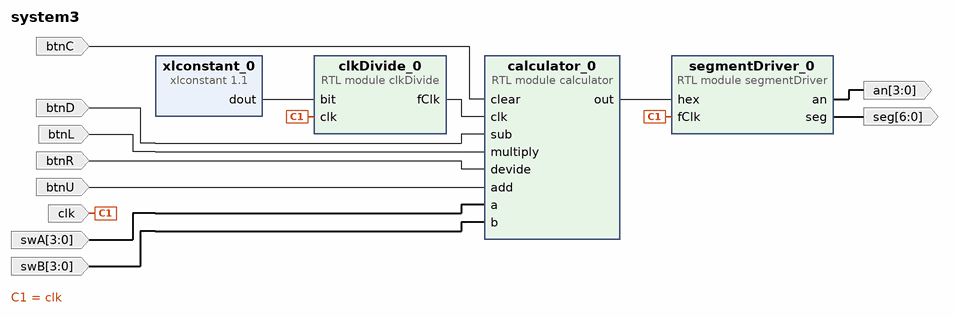
[diagram p0: block diagram of the top level]
# Vivado block design system3, xc7a35tcpg236-1, Vivado 2024.1
create_bd_design system3

create_bd_port -dir I -from 3 -to 0 swA
create_bd_port -dir I -from 3 -to 0 swB
create_bd_port -dir I btnU
create_bd_port -dir I btnD
create_bd_port -dir I btnL
create_bd_port -dir I btnR
create_bd_port -dir I btnC
create_bd_port -dir I clk
create_bd_port -dir O -from 6 -to 0 seg
create_bd_port -dir O -from 3 -to 0 an

create_bd_cell -type module -reference clkDivide clkDivide_0
create_bd_cell -type module -reference segmentDriver segmentDriver_0
create_bd_cell -type module -reference calculator calculator_0
create_bd_cell -type ip -vlnv xilinx.com:ip:xlconstant:1.1 xlconstant_0
set_property -dict {CONFIG.CONST_VAL 10 CONFIG.CONST_WIDTH 5} [get_bd_cells xlconstant_0]

# ---- connections ----

connect_bd_net [get_bd_ports btnC] [get_bd_pins calculator_0/clear]
connect_bd_net [get_bd_ports btnD] [get_bd_pins calculator_0/sub]
connect_bd_net [get_bd_ports btnL] [get_bd_pins calculator_0/multiply]
connect_bd_net [get_bd_ports btnR] [get_bd_pins calculator_0/devide]
connect_bd_net [get_bd_ports btnU] [get_bd_pins calculator_0/add]
connect_bd_net [get_bd_pins calculator_0/out] [get_bd_pins segmentDriver_0/hex]
connect_bd_net [get_bd_pins clkDivide_0/fClk] [get_bd_pins calculator_0/clk]
connect_bd_net [get_bd_ports clk] [get_bd_pins clkDivide_0/clk] [get_bd_pins segmentDriver_0/fClk]
connect_bd_net [get_bd_pins segmentDriver_0/an] [get_bd_ports an]
connect_bd_net [get_bd_pins segmentDriver_0/seg] [get_bd_ports seg]
connect_bd_net [get_bd_ports swA] [get_bd_pins calculator_0/a]
connect_bd_net [get_bd_ports swB] [get_bd_pins calculator_0/b]
connect_bd_net [get_bd_pins xlconstant_0/dout] [get_bd_pins clkDivide_0/bit]

validate_bd_design
save_bd_design
